# EAGLE schematic ESP32-Adapter_V101 (EAGLE 9.6.2)
AUTOREN: Hardi, Jürgen & Dominik; DATUM: 2021-04-05; PROJEKT: MLL - ESP32-Adapter

## Sheet 1 of 2: Adapterplatine
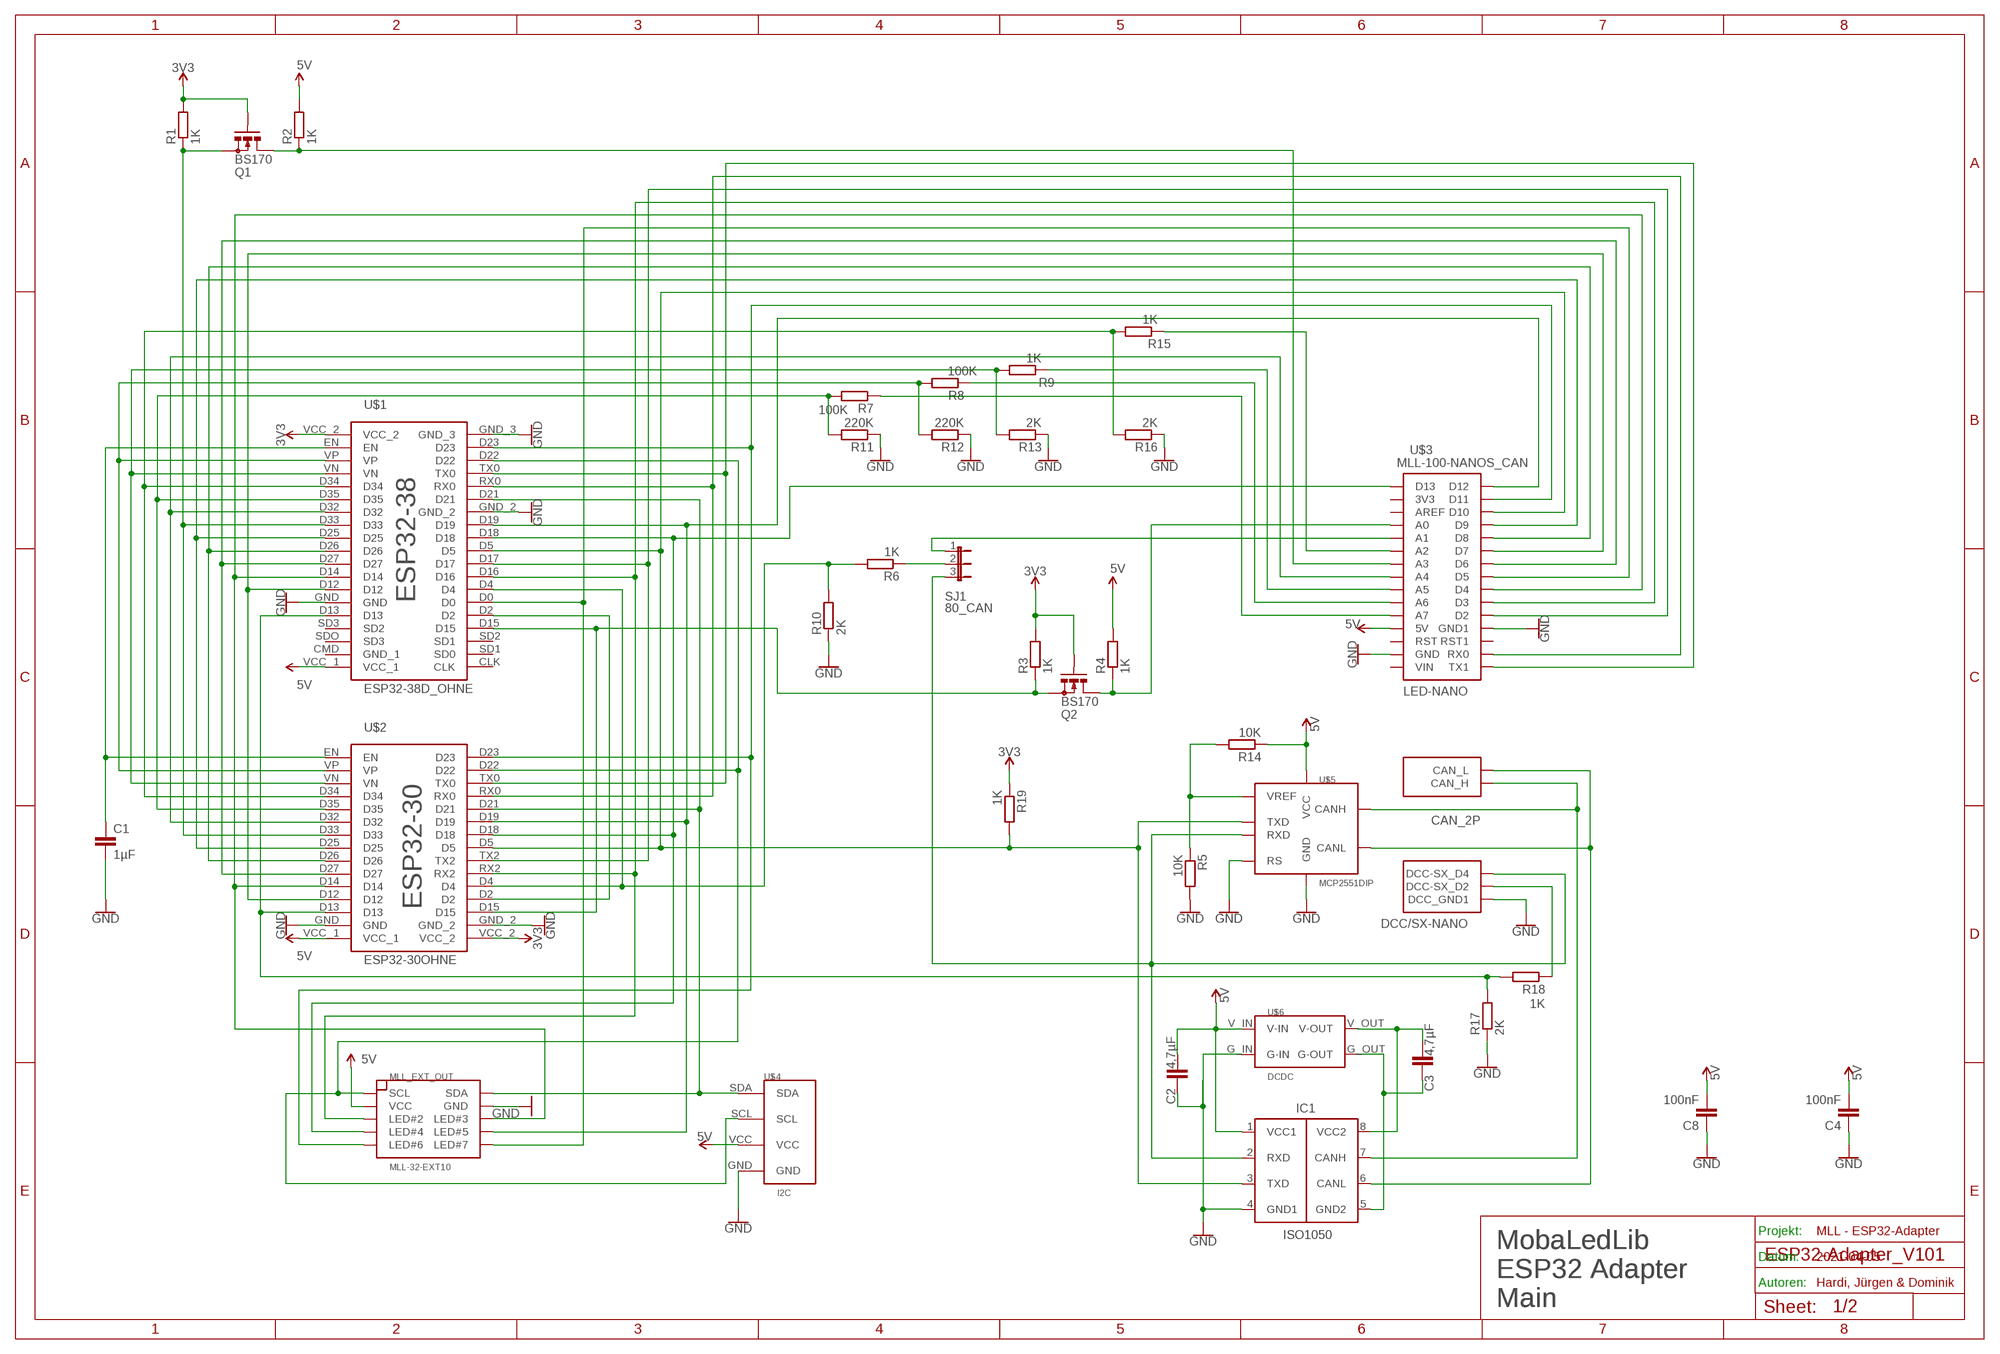
[diagram p0: schematic, sheet 1]

### Parts
C1  1µF  C-EU050-025X075  [C050-025X075]
C2  4,7µF  C-EUC1206  [C1206]
C3  4,7µF  C-EUC1206  [C1206]
C4  100nF  C-EU025-025X050  [C025-025X050]
C8  100nF  C-EU025-025X050  [C025-025X050]
IC1  ISO1050  [DIP08]
MLL_EXT_OUT  MLL-32-EXT10  [IDC10]
Q1  BS170  [SOT54E]
Q2  BS170  [SOT54E]
R1  1K  R-EU_0207/2V  [0207/2V]
R2  1K  R-EU_0207/2V  [0207/2V]
R3  1K  R-EU_0207/2V  [0207/2V]
R4  1K  R-EU_0207/2V  [0207/2V]
R5  10K  R-EU_0207/2V  [0207/2V]
R6  1K  R-EU_0207/2V  [0207/2V]
R7  100K  R-EU_0207/2V  [0207/2V]
R8  100K  R-EU_0207/2V  [0207/2V]
R9  1K  R-EU_0207/2V  [0207/2V]
R10  2K  R-EU_0207/2V  [0207/2V]
R11  220K  R-EU_0204/7  [0204/7]
R12  220K  R-EU_0207/2V  [0207/2V]
R13  2K  R-EU_0204/7  [0204/7]
R14  10K  R-EU_0207/2V  [0207/2V]
R15  1K  R-EU_0207/2V  [0207/2V]
R16  2K  R-EU_0204/7  [0204/7]
R17  2K  R-EU_0207/2V  [0207/2V]
R18  1K  R-EU_0207/2V  [0207/2V]
R19  1K  R-EU_R1206  [R1206]
SJ1  80_CAN  JP2E  [JP2]
U$1  ESP32-38D_OHNE  [ESP32-38D_0]
U$2  ESP32-30OHNE  [ESP32-30_0]
U$3  MLL-100-NANOS_CAN  [MLL-100-1.2NANOS_CAN]
U$4  I2C  I2COCTAGON  [I2C-4S]
U$5  MCP2551DIP  [DIP08]
U$6  DCDC  [DCDC-TEA_NME]

### Nets
A1_80: SJ1.1 U$3.A1
A2_HV: R15.1 U$3.A2
A5: R9.1 U$3.A5
A6_HV: R8.1 U$3.A6
A7_HV: R7.1 U$3.A7
CAN_H: IC1.7(CANH) U$3.CAN_H U$5.7(CANH)
CAN_L: IC1.6(CANL) U$3.CAN_L U$5.6(CANL)
D2: U$1.D2 U$2.D2
D4: R6.2 R10.2 U$1.D4 U$2.D4
D5_CANTX: IC1.3(TXD) R19.2 U$1.D5 U$2.D5 U$3.D10 U$5.1(TXD)
D12: U$1.D12 U$2.D12 U$3.D7
D13: R17.2 R18.2 U$1.D13 U$2.D13
D15: Q2.S R3.1 U$1.D15 U$2.D15
D17: U$1.D17 U$2.TX2 U$3.D2
D26: U$1.D26 U$2.D26 U$3.D8
D27: U$1.D27 U$2.D27 U$3.D6
D32: U$1.D32 U$2.D32 U$3.A4
D33: Q1.S R1.1 U$1.D33 U$2.D33
D34: R15.2 R16.2 U$1.D34 U$2.D34
D35: R7.2 R11.2 U$1.D35 U$2.D35
D36_VP: R8.2 R12.2 U$1.VP U$2.VP
D39_VN: R9.2 R13.2 U$1.VN U$2.VN
DCC_D2_HV: R18.1 U$3.DCC_D2(DCC-SX_D2)
EN: C1.1 U$1.EN U$2.EN
GND: C1.2 C2.1 C4.1 C8.1 IC1.4(GND1) MLL_EXT_OUT.4(GND) R5.2 R10.1 R11.1 R12.1 R13.1 R16.1 R17.1 U$1.GND U$1.GND_2 U$1.GND_3 U$2.GND U$2.GND_2 U$3.DCC_GND1 U$3.GND U$3.GND1 U$4.GND U$5.2(GND) U$5.8(RS) U$6.G_IN(G-IN) ; also sheet 2
GND3: C3.1 IC1.5(GND2) U$6.G_OUT(G-OUT)
LB#2: MLL_EXT_OUT.5(LED#2) U$1.D16 U$2.RX2 U$3.D3 ; also sheet 2
LB#3: MLL_EXT_OUT.6(LED#3) U$1.D14 U$2.D14 U$3.D4 ; also sheet 2
LB#4: MLL_EXT_OUT.7(LED#4) U$1.D18 U$2.D18 U$3.D13 ; also sheet 2
LB#5: MLL_EXT_OUT.8(LED#5) U$1.D19 U$2.D19 U$3.D12 ; also sheet 2
LB#6: MLL_EXT_OUT.9(LED#6) U$1.D23 U$2.D23 U$3.D11 ; also sheet 2
LB#7: MLL_EXT_OUT.10(LED#7) U$1.D0 U$3.D5 ; also sheet 2
N$1: R6.1 SJ1.2
N$3: U$1.D25 U$2.D25 U$3.D9
N$4: Q2.D R4.1 U$3.A0
N$7: R5.1 R14.2 U$5.5(VREF)
N$22: Q1.D R2.1 U$3.A3
RX0: U$1.RX0 U$2.RX0 U$3.RX0
SCL: MLL_EXT_OUT.1(SCL) U$1.D22 U$2.D22 U$4.SCL ; also sheet 2
SDA_D21: MLL_EXT_OUT.2(SDA) U$1.D21 U$2.D21 U$4.SDA ; also sheet 2
SX_D4: IC1.2(RXD) SJ1.3 U$3.DCC_D4(DCC-SX_D4) U$5.4(RXD)
TX0: U$1.TX0 U$2.TX0 U$3.TX1
VCC3: C3.2 IC1.8(VCC2) U$6.V_OUT(V-OUT)
VCC_1: C2.2 C4.2 C8.2 IC1.1(VCC1) MLL_EXT_OUT.3(VCC) R2.2 R4.2 R14.1 U$1.VCC_1 U$2.VCC_1 U$3.5V U$4.VCC U$5.3(VCC) U$6.V_IN(V-IN) ; supply symbol labelled 5V ; also sheet 2
VCC_2: Q1.G Q2.G R1.2 R3.2 R19.1 U$1.VCC_2 U$2.VCC_2 ; supply symbol labelled 3V3
Unconnected: U$1.CLK U$1.SD1(SD0) U$1.SD2(SD1) U$1.SD3(SD2) U$1.SDO(SD3) U$3.3V3 U$3.AREF U$3.RST U$3.RST1

### Notes on the sheet
- Projekt:
- Datum:
- Autoren:
- MobaLedLib 
  ESP32 Adapter
  Main
- MobaLedLib 
  ESP32 Adapter
  Main

## Sheet 2 of 2: Ledbus Erweiterung
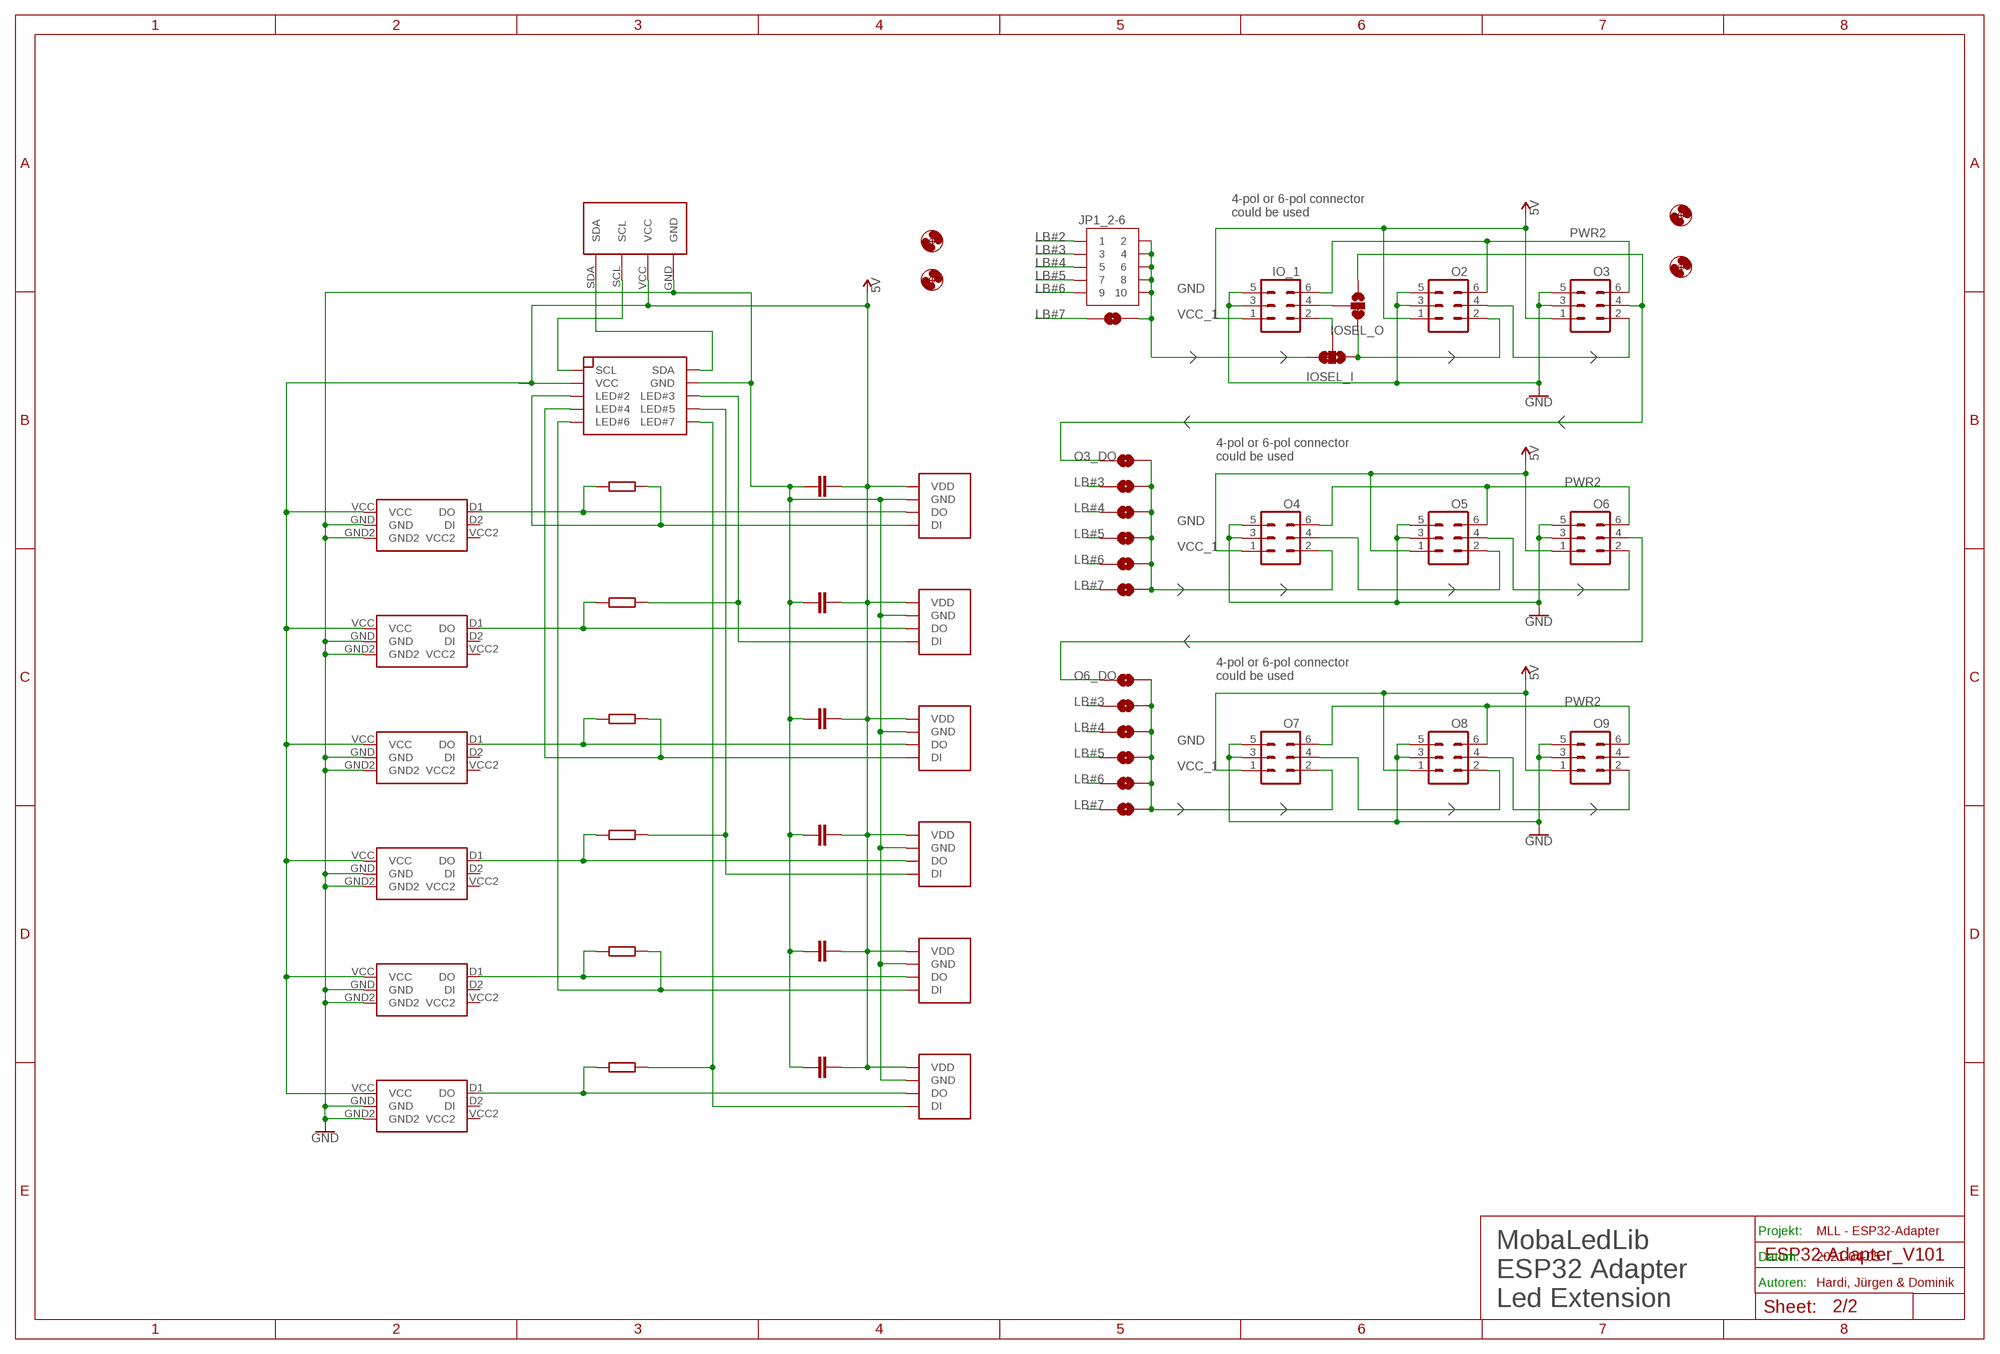
[diagram p1: schematic, sheet 2]

### Parts
CL2  100nF  C-EU025-025X050  [C025-025X050]
CL3  100nF  C-EU025-025X050  [C025-025X050]
CL4  100nF  C-EU025-025X050  [C025-025X050]
CL5  100nF  C-EU025-025X050  [C025-025X050]
CL6  100nF  C-EU025-025X050  [C025-025X050]
CL7  100nF  C-EU025-025X050  [C025-025X050]
H1  MOUNT-HOLE2.8  [2,8]
H2  MOUNT-HOLE2.8  [2,8]
H3  MOUNT-HOLE2.8  [2,8]
H4  MOUNT-HOLE2.8  [2,8]
IO_1  ML6  [ML6]
IOSEL_I  JUMPER-SMT_3_1-NC_TRACE_SILK  [SMT-JUMPER_3_1-NC_TRACE_SILK]
IOSEL_O  JUMPER-SMT_3_1-NC_TRACE_SILK  [SMT-JUMPER_3_1-NC_TRACE_SILK]
J1.7  JUMPER-SMT_2_NO_SILK  [SMT-JUMPER_2_NO_SILK]
J2.2  JUMPER-SMT_2_NO_SILK  [SMT-JUMPER_2_NO_SILK]
J2.3  JUMPER-SMT_2_NO_SILK  [SMT-JUMPER_2_NO_SILK]
J2.4  JUMPER-SMT_2_NO_SILK  [SMT-JUMPER_2_NO_SILK]
J2.5  JUMPER-SMT_2_NO_SILK  [SMT-JUMPER_2_NO_SILK]
J2.6  JUMPER-SMT_2_NO_SILK  [SMT-JUMPER_2_NO_SILK]
J2.7  JUMPER-SMT_2_NO_SILK  [SMT-JUMPER_2_NO_SILK]
J3.2  JUMPER-SMT_2_NO_SILK  [SMT-JUMPER_2_NO_SILK]
J3.3  JUMPER-SMT_2_NO_SILK  [SMT-JUMPER_2_NO_SILK]
J3.4  JUMPER-SMT_2_NO_SILK  [SMT-JUMPER_2_NO_SILK]
J3.5  JUMPER-SMT_2_NO_SILK  [SMT-JUMPER_2_NO_SILK]
J3.6  JUMPER-SMT_2_NO_SILK  [SMT-JUMPER_2_NO_SILK]
J3.7  JUMPER-SMT_2_NO_SILK  [SMT-JUMPER_2_NO_SILK]
JP1_2-6  5XJUMPERL  [5XJUMPER_L]
LB2  WS2812-5050  [5050]
LB3  WS2812-5050  [5050]
LB4  WS2812-5050  [5050]
LB5  WS2812-5050  [5050]
LB6  WS2812-5050  [5050]
LB7  WS2812-5050  [5050]
MLL_EXT_IN  MLL-32-EXT10  [IDC10]
O2  ML6  [ML6]
O3  ML6  [ML6]
O4  ML6  [ML6]
O5  ML6  [ML6]
O6  ML6  [ML6]
O7  ML6  [ML6]
O8  ML6  [ML6]
O9  ML6  [ML6]
OUT2  LED-BUS-OUTPUT  [IDC6]
OUT3  LED-BUS-OUTPUT  [IDC6]
OUT4  LED-BUS-OUTPUT  [IDC6]
OUT5  LED-BUS-OUTPUT  [IDC6]
OUT6  LED-BUS-OUTPUT  [IDC6]
OUT7  LED-BUS-OUTPUT  [IDC6]
RL2  100R  R-EU_0207/2V  [0207/2V]
RL3  100R  R-EU_0207/2V  [0207/2V]
RL4  100R  R-EU_0207/2V  [0207/2V]
RL5  100R  R-EU_0207/2V  [0207/2V]
RL6  100R  R-EU_0207/2V  [0207/2V]
RL7  100R  R-EU_0207/2V  [0207/2V]
U$19  I2C  [I2C-4]

### Nets
DI_IO1: IO_1.2 IOSEL_I.2
DO1_DI2: IOSEL_I.1 IOSEL_O.3 O2.2
DO2: LB2.DO OUT2.D1(DO) RL2.1
DO2_DI3: O2.4 O3.2
DO3: LB3.DO OUT3.D1(DO) RL3.1
DO4: LB4.DO OUT4.D1(DO) RL4.1
DO4_DI5: O4.4 O5.2
DO5: LB5.DO OUT5.D1(DO) RL5.1
DO5_DI6: O5.4 O6.2
DO6: LB6.DO OUT6.D1(DO) RL6.1
DO7: LB7.DO OUT7.D1(DO) RL7.1
DO7_DI8: O7.4 O8.2
DO8_DI9: O8.4 O9.2
DO_IO1_SELECT: IO_1.4 IOSEL_O.2
GND: CL2.1 CL3.1 CL4.1 CL5.1 CL6.1 CL7.1 IO_1.3 IO_1.5 LB2.GND LB3.GND LB4.GND LB5.GND LB6.GND LB7.GND MLL_EXT_IN.4(GND) O2.3 O2.5 O3.3 O3.5 O4.3 O4.5 O5.3 O5.5 O6.3 O6.5 O7.3 O7.5 O8.3 O8.5 O9.3 O9.5 OUT2.GND OUT2.GND2 OUT3.GND OUT3.GND2 OUT4.GND OUT4.GND2 OUT5.GND OUT5.GND2 OUT6.GND OUT6.GND2 OUT7.GND OUT7.GND2 U$19.GND ; also sheet 1
LB#2: JP1_2-6.P$1 LB2.DI MLL_EXT_IN.5(LED#2) RL2.2 ; also sheet 1
LB#3: J2.3.1 J3.3.1 JP1_2-6.P$3 LB3.DI MLL_EXT_IN.6(LED#3) RL3.2 ; also sheet 1
LB#4: J2.4.1 J3.4.1 JP1_2-6.P$5 LB4.DI MLL_EXT_IN.7(LED#4) RL4.2 ; also sheet 1
LB#5: J2.5.1 J3.5.1 JP1_2-6.P$7 LB5.DI MLL_EXT_IN.8(LED#5) RL5.2 ; also sheet 1
LB#6: J2.6.1 J3.6.1 JP1_2-6.P$9 LB6.DI MLL_EXT_IN.9(LED#6) RL6.2 ; also sheet 1
LB#7: J1.7.1 J2.7.1 J3.7.1 LB7.DI MLL_EXT_IN.10(LED#7) RL7.2 ; also sheet 1
O3_DO: IOSEL_O.1 J2.2.1 O3.4
O6_DO: J3.2.1 O6.4
PWR2: IO_1.6 O2.6 O3.6 O4.6 O5.6 O6.6 O7.6 O8.6 O9.6
SCL: MLL_EXT_IN.1(SCL) U$19.SCL ; also sheet 1
SDA_D21: MLL_EXT_IN.2(SDA) U$19.SDA ; also sheet 1
SEL1: IOSEL_I.3 J1.7.2 JP1_2-6.P$2 JP1_2-6.P$4 JP1_2-6.P$6 JP1_2-6.P$8 JP1_2-6.P$10
SEL2: J2.2.2 J2.3.2 J2.4.2 J2.5.2 J2.6.2 J2.7.2 O4.2
SEL3: J3.2.2 J3.3.2 J3.4.2 J3.5.2 J3.6.2 J3.7.2 O7.2
VCC_1: CL2.2 CL3.2 CL4.2 CL5.2 CL6.2 CL7.2 IO_1.1 LB2.VCC(VDD) LB3.VCC(VDD) LB4.VCC(VDD) LB5.VCC(VDD) LB6.VCC(VDD) LB7.VCC(VDD) MLL_EXT_IN.3(VCC) O2.1 O3.1 O4.1 O5.1 O6.1 O7.1 O8.1 O9.1 OUT2.VCC OUT3.VCC OUT4.VCC OUT5.VCC OUT6.VCC OUT7.VCC U$19.VCC ; supply symbol labelled 5V ; also sheet 1
Unconnected: O9.4 OUT2.D2(DI) OUT3.D2(DI) OUT4.D2(DI) OUT5.D2(DI) OUT6.D2(DI) OUT7.D2(DI)

### Notes on the sheet
- 4-pol or 6-pol connector
  could be used
- 4-pol or 6-pol connector
  could be used
- 4-pol or 6-pol connector
  could be used
- Projekt:
- Datum:
- Autoren:
- MobaLedLib 
  ESP32 Adapter
  Led Extension

## Power pins joined to a net without a drawn wire
GND_1: U$1.CMD(GND_1)
VCC2: OUT2.VCC2 OUT3.VCC2 OUT4.VCC2 OUT5.VCC2 OUT6.VCC2 OUT7.VCC2
VIN: U$3.VIN

## Library data of the parts
C1-C4 C8 CL2-CL7 = rcl:C-EU: CAPACITOR, European symbol; SPICEPREFIX: C
H1-H4 = holes:MOUNT-HOLE: MOUNTING HOLE with drill center marker
IC1 = MLL-Dominik-Hardi:ISO1050
IO_1 O2-O9 = con-harting-ml:ML6: HARTING; OC_FARNELL: unknown; OC_NEWARK: unknown
IOSEL_I IOSEL_O = SparkFun-Jumpers:JUMPER-SMT_3_1-NC_TRACE: Normally closed trace jumper (1 of 2 connections) This jumper has a trace between two pads so it's normally closed (NC). The other connection is normally open (NO). Use a razor knife to open the connection. For best results follow the IPC guidelines for cutting traces: Cutout at least 0.063 mm (0.005 in). Remove all loose material to clean up the cut area. Seal the cut with an approved epoxy. Reapply solder to reclose the connection, or to close the NO connection.
J1.7 J2.2-J2.7 J3.2-J3.7 = SparkFun-Jumpers:JUMPER-SMT_2_NO: Normally open jumper This jumper has two pads in close proximity to each other. Apply solder to close the connection. Round pads are easier to solder for beginners, but are a lot larger. SparkFun Product that uses the round pads: SparkFun EL Sequencer <https://www.sparkfun.com/products/12781>
JP1_2-6 = MLL-Dominik-Hardi:5XJUMPER
LB2-LB7 = MLL-Dominik-Hardi:WS2812-
MLL_EXT_IN MLL_EXT_OUT = MLL-Dominik-Hardi:MLL-32-EXT10
OUT2-OUT7 = MLL-Dominik-Hardi:LED-BUS-OUTPUT
Q1 Q2 = transistor-small-signal:BS170: N-CHANNEL MOS FET; SPICEPREFIX: Q
R1-R19 RL2-RL7 = rcl:R-EU_: RESISTOR, European symbol; SPICEPREFIX: R
SJ1 = jumper:JP2E: JUMPER
U$1 = MLL-Dominik-Hardi:ESP32-38
U$2 = MLL-Dominik-Hardi:ESP32-30
U$3 = MLL-Dominik-Hardi:MLL-100-NANOS_CAN
U$4 U$19 = MLL-Dominik-Hardi:I2C
U$5 = MLL-Dominik-Hardi:MCP2551
U$6 = MLL-Dominik-Hardi:DCDC